# EAGLE schematic Tiles_Proto2 (EAGLE 7.4.0)
CNAME: Tiles; CREVISION: A; DESIGNER: Simone Mora
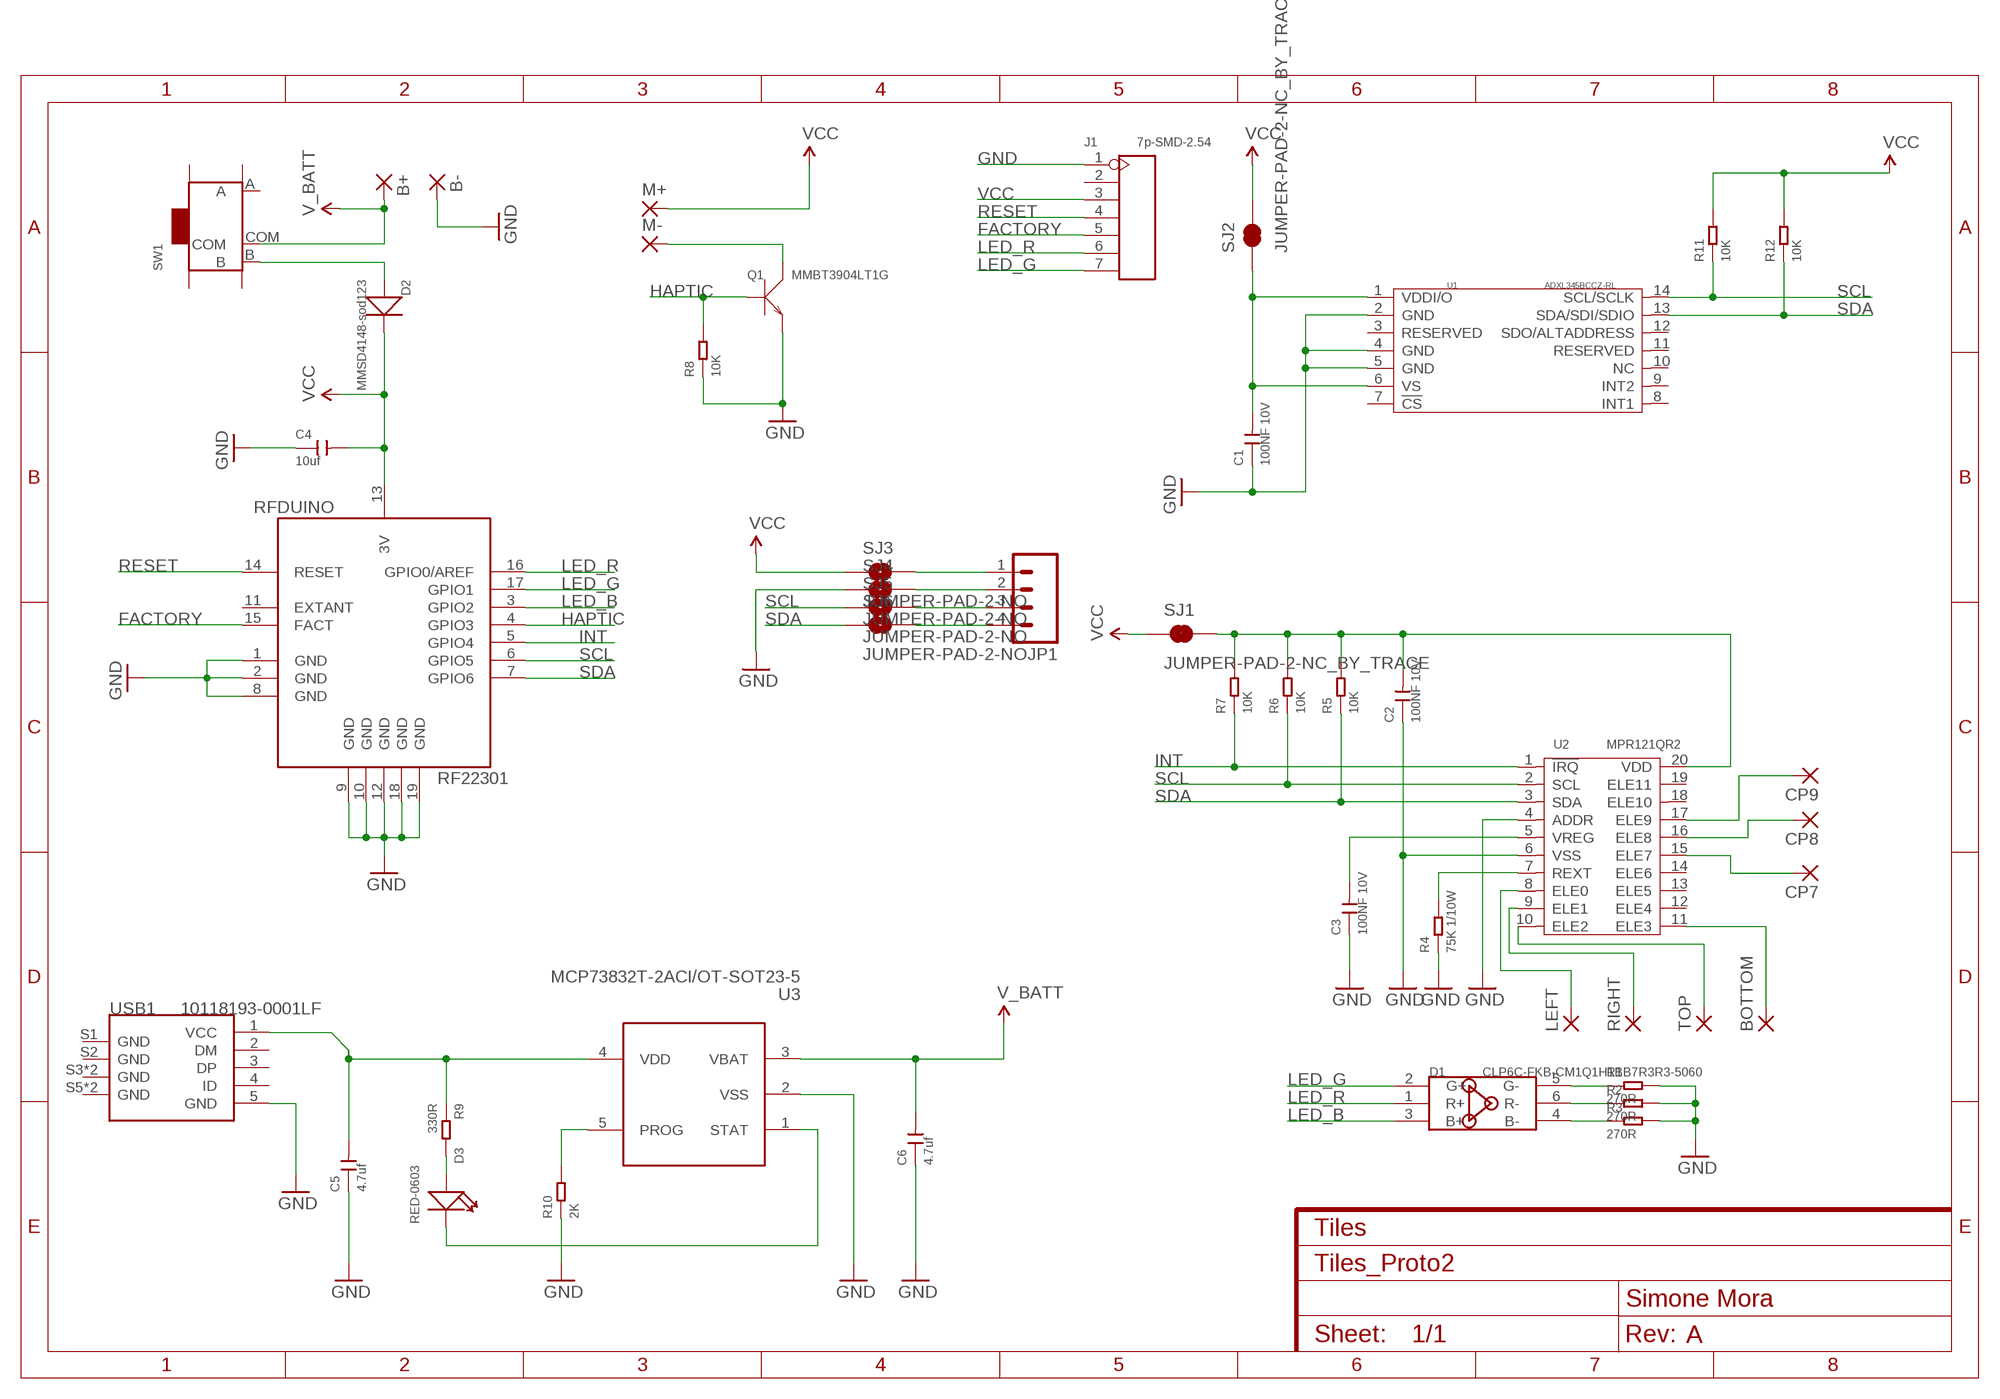
[diagram p0: schematic, sheet 1]

## Parts
B+  SMD2  [SMD1,27-2,54]
B-  SMD2  [SMD1,27-2,54]
BOTTOM  SMD5  [SMD2,54-5,08]
C1  100NF 10V  CERAMIC 100NF-10V-10%-X5R(0402)  [C0402]
C2  100NF 10V  CERAMIC 100NF-10V-10%-X5R(0402)  [C0402]
C3  100NF 10V  CERAMIC 100NF-10V-10%-X5R(0402)  [C0402]
C4  10uf  CERAMIC-10UF-6.3V-20%-X5R(0402)  [C0402]
C5  4.7uf  CERAMIC-4.7UF-6.3V-20%-X5R(0402)  [C0402]
C6  4.7uf  CERAMIC-4.7UF-6.3V-20%-X5R(0402)  [C0402]
CP7  SMD2  [SMD1,27-2,54]
CP8  SMD2  [SMD1,27-2,54]
CP9  SMD2  [SMD1,27-2,54]
D1  CLP6C-FKB-CM1Q1H1BB7R3R3-5060  SMD-LED-RGB(6P-L6.0W5.0H4.0MM)  [LED6-SMD-5060]
D2  MMSD4148-sod123  SMD-DIODE-100V-200MA(SOD-123)  [SOD-123]
D3  RED-0603  LED-SMD-RED-DIFFUSED(0603)  [LED-0603]
J1  7p-SMD-2.54  SMD-BLACK-FEMALE-HEADER(7P-2.54)  [H7-SMD-2.54]
JP1  M04PTH  [1X04]
LEFT  SMD5  [SMD2,54-5,08]
M+  SMD2  [SMD1,27-2,54]
M-  SMD2  [SMD1,27-2,54]
Q1  MMBT3904LT1G  SMD-TRANSISTORS-NPN-40V-200MA-MMBT3904LT1G(SOT-23)  [SOT-23]
R1  270R  SMD-RES-270R-5%-1/4W(1206)  [R0805]
R2  270R  SMD-RES-270R-5%-1/4W(1206)  [R0805]
R3  270R  SMD-RES-270R-5%-1/4W(1206)  [R0805]
R4  75K 1/10W  SMD-RES-75K-1%-1/10W(0603)  [R0603]
R5  10K  SMD-RES-10K-1%-1/10W(0603)  [R0603]
R6  10K  SMD-RES-10K-1%-1/10W(0603)  [R0603]
R7  10K  SMD-RES-10K-1%-1/10W(0603)  [R0603]
R8  10K  SMD-RES-10K-1%-1/10W(0603)  [R0603]
R9  330R  SMD-RES-330R-1%-1/10W(0603)  [R0603]
R10  2K  SMD-RES-2K-5%-1/10W(0603)  [R0603]
R11  10K  SMD-RES-10K-1%-1/10W(0603)  [R0603]
R12  10K  SMD-RES-10K-1%-1/10W(0603)  [R0603]
RFDUINO  RF22301  [RFD22301]
RIGHT  SMD5  [SMD2,54-5,08]
SJ1  JUMPER-PAD-2-NC_BY_TRACE  [PAD-JUMPER-2-NC_BY_TRACE_YES_SILK]
SJ2  JUMPER-PAD-2-NC_BY_TRACE  [PAD-JUMPER-2-NC_BY_TRACE_YES_SILK]
SJ3  JUMPER-PAD-2-NO  [PAD-JUMPER-2-NO_NO_SILK]
SJ4  JUMPER-PAD-2-NO  [PAD-JUMPER-2-NO_NO_SILK]
SJ5  JUMPER-PAD-2-NO  [PAD-JUMPER-2-NO_NO_SILK]
SJ6  JUMPER-PAD-2-NO  [PAD-JUMPER-2-NO_NO_SILK]
SW1  SMD-TOGGLE-SWITCH-ON-ON(3+4P-6.7X2.7MM)  [SW7-SMD-L6.7X2.7X3.2MM]
TOP  SMD5  [SMD2,54-5,08]
U1  ADXL345BCCZ-RL  MOTION/POSITION-ADXL345BCCZ-RL(14P-5.0X3.0MM)  [LGA14-0.8-5.0X3.0MM]
U2  MPR121QR2  TOUCH-MPR121QR2(QFN20)  [QFN20-0.4-3X3M]
U3  MCP73832T-2ACI/OT-SOT23-5  PMIC-MCP73832T-2ACI/OT(SOT23-5)  [SOT-23-5]
USB1  10118193-0001LF  MICRO-USB-SMD-B-(10118193-0001LF)  [MICRO-USB5+6P-SMD-0.65-B]

## Nets
FACTORY: J1.5 RFDUINO.15(FACT)
GND: B-.1(P) C1.1 C2.1 C3.1 C4.1 C5.1 C6.1 J1.1 Q1.2(E) R1.2 R2.2 R3.2 R4.1 R8.1 R10.1 RFDUINO.1(GND) RFDUINO.2(GND) RFDUINO.8(GND) RFDUINO.9(GND) RFDUINO.10(GND) RFDUINO.12(GND) RFDUINO.18(GND) RFDUINO.19(GND) SJ4.1 U1.2(GND) U1.4(GND) U1.5(GND) U2.4(ADDR) U2.6(VSS) U3.2(VSS) USB1.5(GND)
HAPTIC: Q1.1(B) R8.2 RFDUINO.4(GPIO3)
INT: R7.1 RFDUINO.5(GPIO4) U2.1(!IRQ)
LED_B: D1.3(B+) RFDUINO.3(GPIO2)
LED_G: D1.2(G+) J1.7 RFDUINO.17(GPIO1)
LED_R: D1.1(R+) J1.6 RFDUINO.16(GPIO0/AREF)
N$1: D1.5(G-) R1.1
N$2: D1.6(R-) R2.1
N$3: D1.4(B-) R3.1
N$4: C3.2 U2.5(VREG)
N$5: R4.2 U2.7(REXT)
N$6: JP1.1 SJ3.2
N$7: M-.1(P) Q1.3(C)
N$8: C5.2 R9.1 U3.4(VDD) USB1.1(VCC)
N$9: D2.+ SW1.B
N$10: D3.+ R9.2
N$11: D3.- U3.1(STAT)
N$12: R10.2 U3.5(PROG)
N$13: JP1.2 SJ4.2
N$14: JP1.3 SJ5.2
N$15: JP1.4 SJ6.2
N$16: LEFT.1(P) U2.8(ELE0)
N$17: RIGHT.1(P) U2.9(ELE1)
N$18: TOP.1(P) U2.10(ELE2)
N$19: BOTTOM.1(P) U2.11(ELE3)
N$20: CP7.1(P) U2.15(ELE7)
N$21: CP8.1(P) U2.16(ELE8)
N$22: CP9.1(P) U2.17(ELE9)
N$24: C2.2 R5.2 R6.2 R7.2 SJ1.2 U2.20(VDD)
RESET: J1.4 RFDUINO.14(RESET)
SCL: R6.1 R11.1 RFDUINO.6(GPIO5) SJ5.1 U1.14(SCL/SCLK) U2.2(SCL)
SDA: R5.1 R12.1 RFDUINO.7(GPIO6) SJ6.1 U1.13(SDA/SDI/SDIO) U2.3(SDA)
V_BATT: B+.1(P) C6.2 SW1.COM U3.3(VBAT)
VCC: C4.2 D2.- J1.3 M+.1(P) R11.2 R12.2 RFDUINO.13(3V) SJ1.1 SJ2.2 SJ3.1
VDDI/O: C1.2 SJ2.1 U1.1(VDDI/O) U1.6(VS)
Unconnected: J1.2 RFDUINO.11(EXTANT) SW1.A SW1.SS1 SW1.SS2 SW1.SS3 SW1.SS4 U1.3(RESERVED) U1.7(!CS) U1.8(INT1) U1.9(INT2) U1.10(NC) U1.11(RESERVED) U1.12(SDO/ALTADDRESS) U2.12(ELE4) U2.13(ELE5) U2.14(ELE6) U2.18(ELE10) U2.19(ELE11) USB1.2(DM) USB1.3(DP) USB1.4(ID) USB1.S1(GND) USB1.S2(GND) USB1.S3(GND) USB1.S4(GND) USB1.S5(GND) USB1.S6(GND)

## Library data of the parts
B+ B- CP7-CP9 M+ M- = wirepad:SMD2: SMD PAD
BOTTOM LEFT RIGHT TOP = wirepad:SMD5: SMD PAD
C1-C3 = Seeed-OPL-Capacitor:CERAMIC 100NF-10V-10%-X5R(0402): 302010037; MPN: CC0402KRX5R6BB104
C4 = Seeed-OPL-Capacitor:CERAMIC-10UF-6.3V-20%-X5R(0402): 302010053; MPN: CC0402MRX5R5BB106
C5 C6 = Seeed-OPL-Capacitor:CERAMIC-4.7UF-6.3V-20%-X5R(0402): 302010019; MPN: CC0402MRX5R5BB475
D1 = Seeed-OPL-Diode:SMD-LED-RGB(6P-L6.0*W5.0*H4.0MM): 304090150; MPN: CLP6C-FKB-CM1Q1H1BB7R3R3
D2 = Seeed-OPL-Diode:SMD-DIODE-100V-200MA(SOD-123): 304010007; MPN: MMSD4148
D3 = Seeed-OPL-Diode:LED-SMD-RED-DIFFUSED(0603): 304090042; MPN: 19-217-R6C-AL1M2VY-3T
J1 = Seeed-OPL-Connector:SMD-BLACK-FEMALE-HEADER(7P-2.54): 320030106; MPN: F171-1107A0BMU01
JP1 = SparkFun-Connectors:M04: Header 4 Standard 4-pin 0.1" header. Use with straight break away headers (SKU : PRT-00116), right angle break away headers (PRT-00553), swiss pins (PRT-00743), machine pins (PRT-00117), and female headers (PRT-00115). Molex polarized connector foot print use with SKU : PRT-08231 with associated crimp pins and housings. 1MM SMD Version SKU: PRT-10208
Q1 = Seeed-OPL-Transistor:SMD-TRANSISTORS-NPN-40V-200MA-MMBT3904LT1G(SOT-23): 305010013; MPN: MMBT3904LT1G
R1-R3 = Seeed-OPL-Resistor:SMD-RES-270R-5%-1/4W(1206): 301010418; MPN: RC1206JR-07270RL
R4 = Seeed-OPL-Resistor:SMD-RES-75K-1%-1/10W(0603): 301010247; MPN: RC0603FR-0775KL
R5-R8 R11 R12 = Seeed-OPL-Resistor:SMD-RES-10K-1%-1/10W(0603): 301010299; MPN: RC0603FR-0710KL
R9 = Seeed-OPL-Resistor:SMD-RES-330R-1%-1/10W(0603): 301010300; MPN: RC0603FR-07330RL
R10 = Seeed-OPL-Resistor:SMD-RES-2K-5%-1/10W(0603): 301010113; MPN: RC0603JR-072KL
RFDUINO = GeekAmmo:RF22301: RFD22301 RFDuino Bluetooth 4.0 Low Energy BLE RF Module With Built-In ARM Cortex M0 Microconroller Hi performance, professional grade Bluetooth 4.0 Low Energy radio transceiver with built-in ARM Cortex M0 microcontroller that can be programmed using the simple-to-use Arduino IDE using RFduino extensions. Built-in user application microcontroller with ADC, I2C, SPI, UART and GPIO. http://www.rfduino.com/
SJ1 SJ2 = SparkFun-Passives:JUMPER-PAD-2-NC_BY_TRACE
SJ3-SJ6 = SparkFun-Passives:JUMPER-PAD-2-NO
SW1 = Seeed-OPL-Switch:SMD-TOGGLE-SWITCH-ON-ON(3+4P-6.7X2.7MM): 311030001
U1 = Seeed-OPL-sensor:MOTION/POSITION-ADXL345BCCZ-RL(14P-5.0X3.0MM): 314080008; MPN: ADXL345BCCZ-RL
U2 = Seeed-OPL-sensor:TOUCH-MPR121QR2(QFN20): 314160001; MPN: MPR121QR2
U3 = Seeed-OPL-ic:PMIC-MCP73832T-2ACI/OT(SOT23-5): 310030238; MPN: MCP73832T-2ACI/OT
USB1 = Seeed-OPL-Connector:MICRO-USB-SMD-B-(10118193-0001LF): 320010003; MPN: 10118193-0001LF